# Altium schematic sheet GameControl.SchDoc: Game Control
size A4
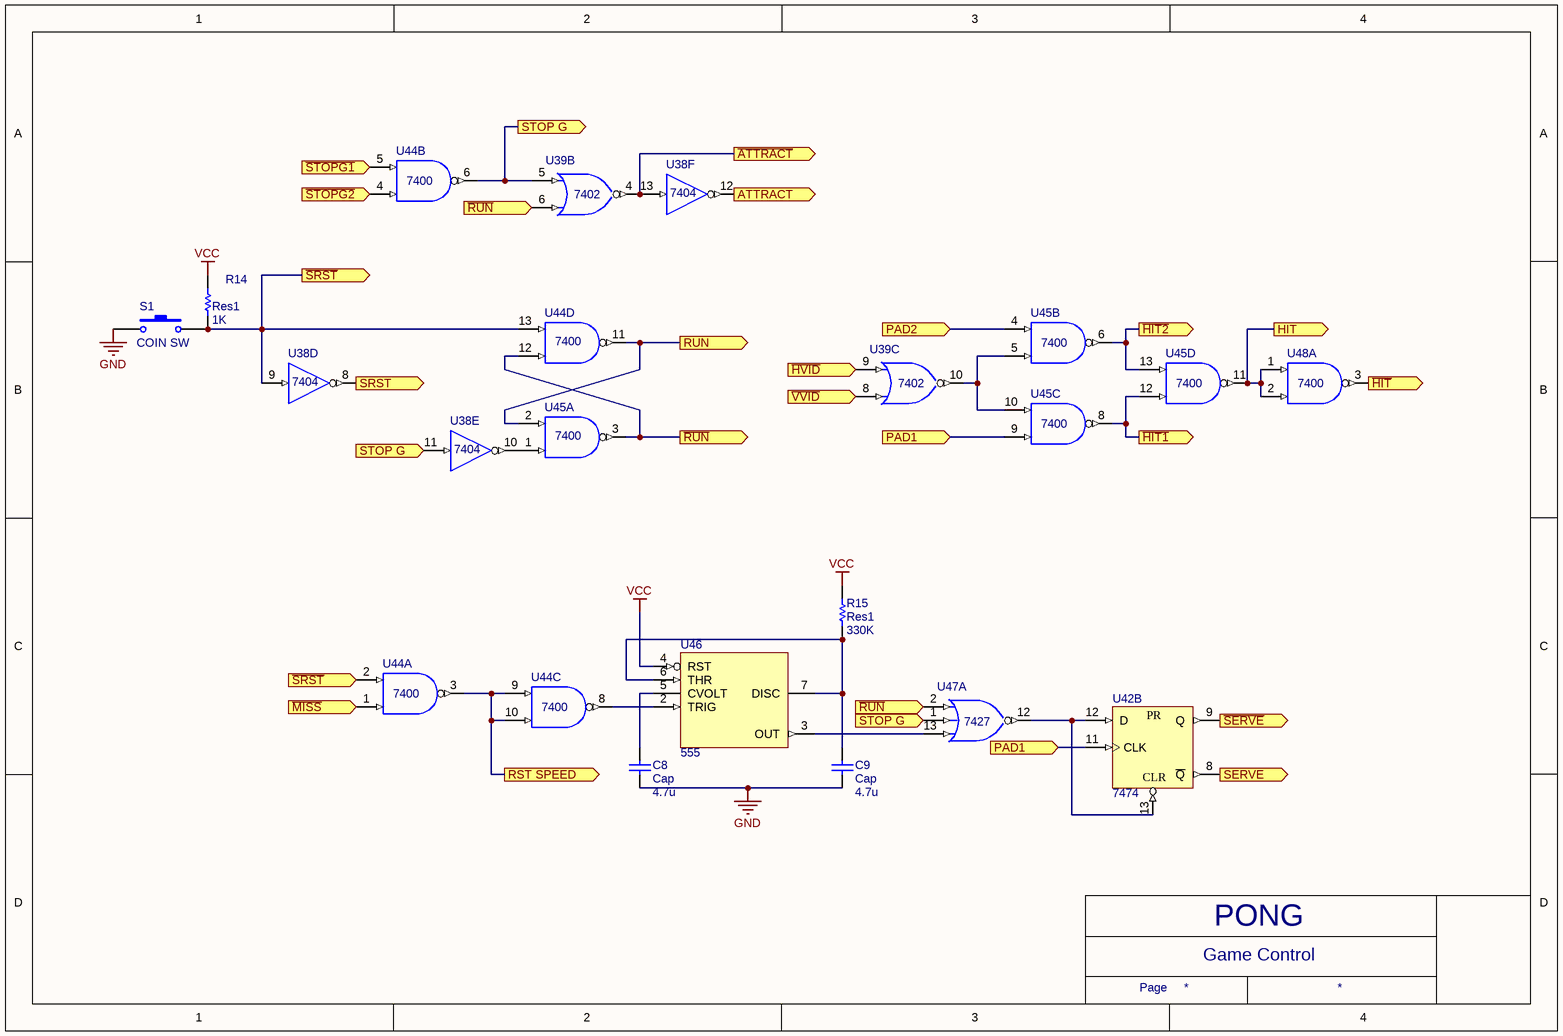
[diagram p0: GameControl.SchDoc]

## Parts
C8  Cap  value 4.7u  [CAPR10.16-11.5x3.6]
C9  Cap  value 4.7u  [CAPR10.16-11.5x3.6]
R14  Res1  value 1K  [AXIAL-0.4]
R15  Res1  value 330K  [AXIAL-0.4]
S1  COIN SW  [SPST-2]
U38  7404  [N014]  (parts D,E,F of 6)
U39  7402  [N014]  (parts B,C of 4)
U42  7474  [N014D]  (part B of 2)
U44  7400  [N014]  (parts A,B,C,D of 4)
U45  7400  [N014]  (parts A,B,C,D of 4)
U46  555  [P008]
U47  7427  [N014]  (part A of 3)
U48  7400  [N014]  (part A of 4)

## Ports
ATTRACT, HIT, PAD1, PAD2, RST SPEED, RUN, SERVE, SRST, STOP G, ~{ATTRACT}, ~{HIT1}, ~{HIT2}, ~{HIT}, ~{HVID}, ~{MISS}, ~{RUN}, ~{SERVE}, ~{SRST}, ~{STOPG1}, ~{STOPG2}, ~{VVID}

## Nets
GND: C8.1 C9.1 S1.1 U38.7(GND) U39.7(GND) U42.7(GND) U44.7(GND) U45.7(GND) U46.1(GND) U47.7(GND) U48.7(GND)
VCC: R14.2 R15.2 U38.14(VCC) U39.14(VCC) U42.10(PR) U42.14(VCC) U44.14(VCC) U45.14(VCC) U46.4(RST) U46.8(VCC) U47.14(VCC) U48.14(VCC)
~{ATTRACT}: U38.13(A) U39.4(Y) ; port ~{ATTRACT}
~{HIT}: U48.3(Y) ; port ~{HIT}
~{HIT1}: U45.8(Y) U45.12(A) ; port ~{HIT1}
~{HIT2}: U45.6(Y) U45.13(B) ; port ~{HIT2}
~{HVID}: U39.9(B) ; port ~{HVID}
~{MISS}: U44.1(A) ; port ~{MISS}
~{RUN}: U39.6(B) U44.12(A) U45.3(Y) U47.2(B) ; port ~{RUN}
~{SERVE}: U42.9(Q) ; port ~{SERVE}
~{SRST}: R14.1 S1.2 U38.9(A) U44.2(B) U44.13(B) ; port ~{SRST}
~{STOPG1}: U44.5(B) ; port ~{STOPG1}
~{STOPG2}: U44.4(A) ; port ~{STOPG2}
~{VVID}: U39.8(A) ; port ~{VVID}
ATTRACT: U38.12(Y) ; port ATTRACT
HIT: U45.11(Y) U48.1(A) U48.2(B) ; port HIT
PAD1: U42.11(CLK) U45.9(A) ; port PAD1
PAD2: U45.4(A) ; port PAD2
RST SPEED: U44.3(Y) U44.9(A) U44.10(B) ; port RST SPEED
RUN: U44.11(Y) U45.2(B) ; port RUN
SERVE: U42.8(~{Q}) ; port SERVE
SRST: U38.8(Y) ; port SRST
STOP G: U38.11(A) U39.5(A) U44.6(Y) U47.1(A) ; port STOP G
NetC8_2: C8.2 U46.5(CVOLT)
NetC9_2: C9.2 R15.1 U46.6(THR) U46.7(DISC)
NetU38_10: U38.10(Y) U45.1(A)
NetU39_10: U39.10(Y) U45.5(B) U45.10(B)
NetU42_12: U42.12(D) U42.13(CLR) U47.12(Y)
NetU44_8: U44.8(Y) U46.2(TRIG)
NetU46_3: U46.3(OUT) U47.13(C)

## Notes on the sheet
- Text
- Page
- PONG

## Library data of the parts
C8 C9 = Cap: Capacitor; Published: 8-Jun-2000; LatestRevisionDate: 17-Jul-2002; LatestRevisionNote: Re-released for DXP Platform.; PackageReference: RAD-0.3; Publisher: Altium Limited; PackageDescription: Radial Cap, Thru-Hole; 2 Leads; 0.3 in Pin Spacing
R14 R15 = Res1: Resistor; Published: 8-Jun-2000; LatestRevisionDate: 17-Jul-2002; LatestRevisionNote: Re-released for DXP Platform.; PackageReference: AXIAL-0.3; Publisher: Altium Limited; PackageDescription: Axial Device, Thru-Hole; 2 Leads; 0.3 in Pin Spacing
S1 = SW-PB: Switch; Published: 24-Mar-1999; LatestRevisionDate: 17-Jul-2002; LatestRevisionNote: Re-released for DXP Platform.; PackageReference: SPST-2; Publisher: Altium Limited; PackageDescription: Switch; 2 Leads
U38 = SN74LS04N: Hex Inverter; Published: 8-Jun-2000; LatestRevisionDate: 04-Mar-2005; LatestRevisionNote: Stylized 3D Model Added.; DatasheetVersion: Mar-1988; PackageVersion: Oct-1995; PackageReference: N014; Publisher: Altium Limited; PackageDescription: DIP; 14 Leads; Row Spacing 7.62 mm; Pitch 2.54 mm; ComponentLink1Description: Manufacturer Link; ComponentLink1URL: http://www.ti.com/; ComponentLink2Description: Datasheet; ComponentLink2URL: http://www-s.ti.com/sc/ds/sn74ls04.pdf
U39 = SN74LS02N: Quadruple 2-Input Positive-NOR Gate; Published: 8-Jun-2000; LatestRevisionDate: 04-Mar-2005; LatestRevisionNote: Stylized 3D Model Added.; DatasheetVersion: Mar-1988; PackageVersion: Oct-1995; PackageReference: N014; Publisher: Altium Limited; PackageDescription: DIP; 14 Leads; Row Spacing 7.62 mm; Pitch 2.54 mm; ComponentLink1Description: Manufacturer Link; ComponentLink1URL: http://www.ti.com/; ComponentLink2Description: Datasheet; ComponentLink2URL: http://www-s.ti.com/sc/ds/sn54s02.pdf
U42 = SN74LS74AN: Dual D-Type Positive-Edge-Triggered Flip-Flop with Preset and Clear; Published: 8-Jun-2000; LatestRevisionDate: 04-Mar-2005; LatestRevisionNote: Stylized 3D Model Added.; DatasheetVersion: Mar-1988; PackageVersion: Oct-1995; PackageReference: N014D; Publisher: Altium Limited; PackageDescription: DIP; 14 Leads; Row Spacing 7.62 mm; Pitch 2.54 mm; ComponentLink1Description: Manufacturer Link; ComponentLink1URL: http://www.ti.com/; ComponentLink2Description: Datasheet; ComponentLink2URL: http://www-s.ti.com/sc/ds/sn74ls74a.pdf
U44 U45 U48 = SN74LS00N: Quadruple 2-Input Positive-NAND Gate; Published: 8-Jun-2000; LatestRevisionDate: 04-Mar-2005; LatestRevisionNote: Stylized 3D Model Added.; DatasheetVersion: Mar-1988; PackageVersion: Oct-1995; PackageReference: N014; Publisher: Altium Limited; PackageDescription: DIP; 14 Leads; Row Spacing 7.62 mm; Pitch 2.54 mm; ComponentLink1Description: Manufacturer Link; ComponentLink1URL: http://www.ti.com/; ComponentLink2Description: Datasheet; ComponentLink2URL: http://www-s.ti.com/sc/ds/sn74ls00.pdf
U46 = NE555P: Precision Timer; Published: 16-Jan-2001; LatestRevisionDate: 04-Mar-2005; LatestRevisionNote: Stylized 3D Model Added.; DatasheetVersion: Feb-1992; PackageVersion: Jun-1999; PackageReference: P008; Publisher: Altium Limited; PackageDescription: DIP; 8 Leads; Row Spacing 7.62 mm; Pitch 2.54 mm; Code_JEDEC: MO-001-AN; ComponentLink1Description: Manufacturer Link; ComponentLink1URL: http://www.ti.com/; ComponentLink2Description: Datasheet; ComponentLink2URL: http://www-s.ti.com/sc/ds/ne555.pdf
U47 = SN74LS27N: Triple 3-Input Positive-NOR Gate; Published: 8-Jun-2000; LatestRevisionDate: 04-Mar-2005; LatestRevisionNote: Stylized 3D Model Added.; DatasheetVersion: Mar-1988; PackageVersion: Oct-1995; PackageReference: N014; Publisher: Altium Limited; PackageDescription: DIP; 14 Leads; Row Spacing 7.62 mm; Pitch 2.54 mm; ComponentLink1Description: Manufacturer Link; ComponentLink1URL: http://www.ti.com/; ComponentLink2Description: Datasheet; ComponentLink2URL: http://www-s.ti.com/sc/ds/sn74ls27.pdf